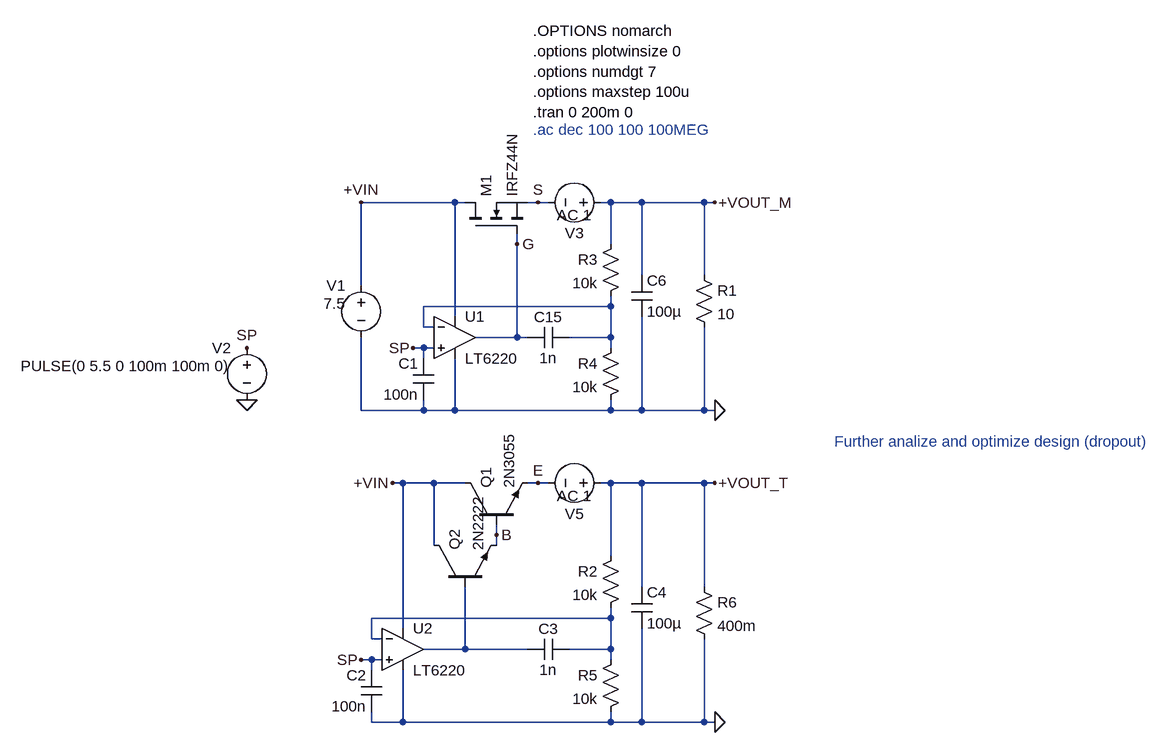
[diagram p0: schematic Linear-regulator.asc]
Linear-regulator.asc, the LTspice schematic file:
Version 4
SHEET 1 4944 2476
WIRE 912 -2032 768 -2032
WIRE 928 -2032 912 -2032
WIRE 1040 -2032 1024 -2032
WIRE 1056 -2032 1040 -2032
WIRE 1152 -2032 1136 -2032
WIRE 1200 -2032 1152 -2032
WIRE 1296 -2032 1200 -2032
WIRE 1312 -2032 1296 -2032
WIRE 1008 -1968 1008 -1984
WIRE 1152 -1968 1152 -2032
WIRE 1200 -1920 1200 -2032
WIRE 1296 -1920 1296 -2032
WIRE 768 -1904 768 -2032
WIRE 1152 -1872 1152 -1888
WIRE 1152 -1872 864 -1872
WIRE 912 -1856 912 -2032
WIRE 864 -1840 864 -1872
WIRE 880 -1840 864 -1840
WIRE 1008 -1824 1008 -1968
WIRE 1008 -1824 944 -1824
WIRE 1024 -1824 1008 -1824
WIRE 1152 -1824 1152 -1872
WIRE 1152 -1824 1088 -1824
WIRE 864 -1808 848 -1808
WIRE 880 -1808 864 -1808
WIRE 1152 -1808 1152 -1824
WIRE 864 -1792 864 -1808
WIRE 768 -1712 768 -1824
WIRE 864 -1712 864 -1728
WIRE 864 -1712 768 -1712
WIRE 912 -1712 912 -1792
WIRE 912 -1712 864 -1712
WIRE 1152 -1712 1152 -1728
WIRE 1152 -1712 912 -1712
WIRE 1200 -1712 1200 -1856
WIRE 1200 -1712 1152 -1712
WIRE 1296 -1712 1296 -1840
WIRE 1296 -1712 1200 -1712
WIRE 1312 -1712 1296 -1712
WIRE 832 -1600 816 -1600
WIRE 880 -1600 832 -1600
WIRE 928 -1600 880 -1600
WIRE 1040 -1600 1024 -1600
WIRE 1056 -1600 1040 -1600
WIRE 1152 -1600 1136 -1600
WIRE 1200 -1600 1152 -1600
WIRE 1296 -1600 1200 -1600
WIRE 1312 -1600 1296 -1600
WIRE 976 -1520 976 -1536
WIRE 880 -1504 880 -1600
WIRE 976 -1504 976 -1520
WIRE 1152 -1488 1152 -1600
WIRE 1200 -1440 1200 -1600
WIRE 1296 -1440 1296 -1600
WIRE 1152 -1392 1152 -1408
WIRE 1152 -1392 784 -1392
WIRE 832 -1376 832 -1600
WIRE 784 -1360 784 -1392
WIRE 800 -1360 784 -1360
WIRE 928 -1344 928 -1440
WIRE 928 -1344 864 -1344
WIRE 1024 -1344 928 -1344
WIRE 1152 -1344 1152 -1392
WIRE 1152 -1344 1088 -1344
WIRE 784 -1328 768 -1328
WIRE 800 -1328 784 -1328
WIRE 1152 -1328 1152 -1344
WIRE 784 -1312 784 -1328
WIRE 784 -1232 784 -1248
WIRE 832 -1232 832 -1312
WIRE 832 -1232 784 -1232
WIRE 1152 -1232 1152 -1248
WIRE 1152 -1232 832 -1232
WIRE 1200 -1232 1200 -1376
WIRE 1200 -1232 1152 -1232
WIRE 1296 -1232 1296 -1360
WIRE 1296 -1232 1200 -1232
WIRE 1312 -1232 1296 -1232
FLAG 1312 -1712 0
FLAG 768 -2032 +VIN
FLAG 1312 -2032 +VOUT_M
FLAG 1040 -2032 S
FLAG 848 -1808 SP
FLAG 1008 -1968 G
FLAG 592 -1728 0
FLAG 592 -1808 SP
FLAG 1312 -1232 0
FLAG 816 -1600 +VIN
FLAG 1312 -1600 +VOUT_T
FLAG 1040 -1600 E
FLAG 768 -1328 SP
FLAG 976 -1520 B
SYMBOL cap 880 -1792 M0
SYMATTR InstName C1
SYMATTR Value 100n
SYMBOL voltage 768 -1920 M0
WINDOW 123 0 0 Left 0
WINDOW 39 0 0 Left 0
WINDOW 3 24 44 Left 2
SYMATTR InstName V1
SYMATTR Value 7.5
SYMBOL voltage 1152 -2032 M270
WINDOW 0 -32 56 VBottom 2
WINDOW 3 32 56 VTop 2
WINDOW 123 -4 56 VBottom 2
WINDOW 39 0 0 Left 0
SYMATTR InstName V3
SYMATTR Value ""
SYMATTR Value2 AC 1
SYMBOL cap 1088 -1840 R90
WINDOW 0 0 32 VBottom 2
WINDOW 3 32 32 VTop 2
SYMATTR InstName C15
SYMATTR Value 1n
SYMBOL cap 1184 -1920 R0
SYMATTR InstName C6
SYMATTR Value 100µ
SYMATTR SpiceLine Rser=10m
SYMBOL res 1168 -1984 M0
SYMATTR InstName R3
SYMATTR Value 10k
SYMBOL res 1168 -1824 M0
SYMATTR InstName R4
SYMATTR Value 10k
SYMBOL OpAmps\\LT6220 912 -1824 R0
SYMATTR InstName U1
SYMBOL nmos 928 -1984 R270
SYMATTR InstName M1
SYMATTR Value IRFZ44N
SYMBOL voltage 592 -1824 M0
WINDOW 123 0 0 Left 0
WINDOW 39 0 0 Left 0
WINDOW 3 24 44 Left 2
SYMATTR InstName V2
SYMATTR Value PULSE(0 5.5 0 100m 100m 0)
SYMBOL res 1280 -1936 R0
SYMATTR InstName R1
SYMATTR Value 10
SYMBOL npn 928 -1536 R270
SYMATTR InstName Q1
SYMATTR Value 2N3055
SYMBOL cap 800 -1312 M0
SYMATTR InstName C2
SYMATTR Value 100n
SYMBOL voltage 1152 -1600 M270
WINDOW 0 -32 56 VBottom 2
WINDOW 3 32 56 VTop 2
WINDOW 123 -4 56 VBottom 2
WINDOW 39 0 0 Left 0
SYMATTR InstName V5
SYMATTR Value ""
SYMATTR Value2 AC 1
SYMBOL cap 1088 -1360 R90
WINDOW 0 0 32 VBottom 2
WINDOW 3 32 32 VTop 2
SYMATTR InstName C3
SYMATTR Value 1n
SYMBOL cap 1184 -1440 R0
SYMATTR InstName C4
SYMATTR Value 100µ
SYMATTR SpiceLine Rser=10m
SYMBOL res 1168 -1504 M0
SYMATTR InstName R2
SYMATTR Value 10k
SYMBOL res 1168 -1344 M0
SYMATTR InstName R5
SYMATTR Value 10k
SYMBOL OpAmps\\LT6220 832 -1344 R0
SYMATTR InstName U2
SYMBOL res 1280 -1456 R0
SYMATTR InstName R6
SYMATTR Value 400m
SYMBOL npn 880 -1440 R270
SYMATTR InstName Q2
SYMATTR Value 2N2222
TEXT 1032 -2296 Left 2 !.OPTIONS nomarch\n.options plotwinsize 0\n.options numdgt 7\n.options maxstep 100u\n.tran 0 200m 0
TEXT 1032 -2144 Left 2 ;.ac dec 100 100 100MEG
TEXT 1496 -1664 Left 2 ;Further analize and optimize design (dropout)

The netlist it stands for:
* Linear-regulator.asc
C1 SP 0 100n
V1 +VIN 0 7.5
V3 +VOUT_M S AC 1
C15 N001 G 1n
C6 +VOUT_M 0 100µ Rser=10m
R3 +VOUT_M N001 10k
R4 N001 0 10k
XU1 SP N001 +VIN 0 G LT6220  ; pins In+ In- V+ V- OUT
M1 +VIN G S S IRFZ44N
V2 SP 0 PULSE(0 5.5 0 100m 100m 0)
R1 +VOUT_M 0 10
Q1 +VIN B E 0 2N3055
C2 SP 0 100n
V5 +VOUT_T E AC 1
C3 N002 N003 1n
C4 +VOUT_T 0 100µ Rser=10m
R2 +VOUT_T N002 10k
R5 N002 0 10k
XU2 SP N002 +VIN 0 N003 LT6220  ; pins In+ In- V+ V- OUT
R6 +VOUT_T 0 400m
Q2 +VIN N003 B 0 2N2222
.model NPN NPN
.model PNP PNP
.lib standard.bjt
.model NMOS NMOS
.model PMOS PMOS
.lib standard.mos
.OPTIONS nomarch
.options plotwinsize 0
.options numdgt 7
.options maxstep 100u
.tran 0 200m 0
* .ac dec 100 100 100MEG
* Further analize and optimize design (dropout)
.lib LTC4.lib
.backanno
.end